# EAGLE design AddOnBoardArduinoRTC (EAGLE 7.6.0)
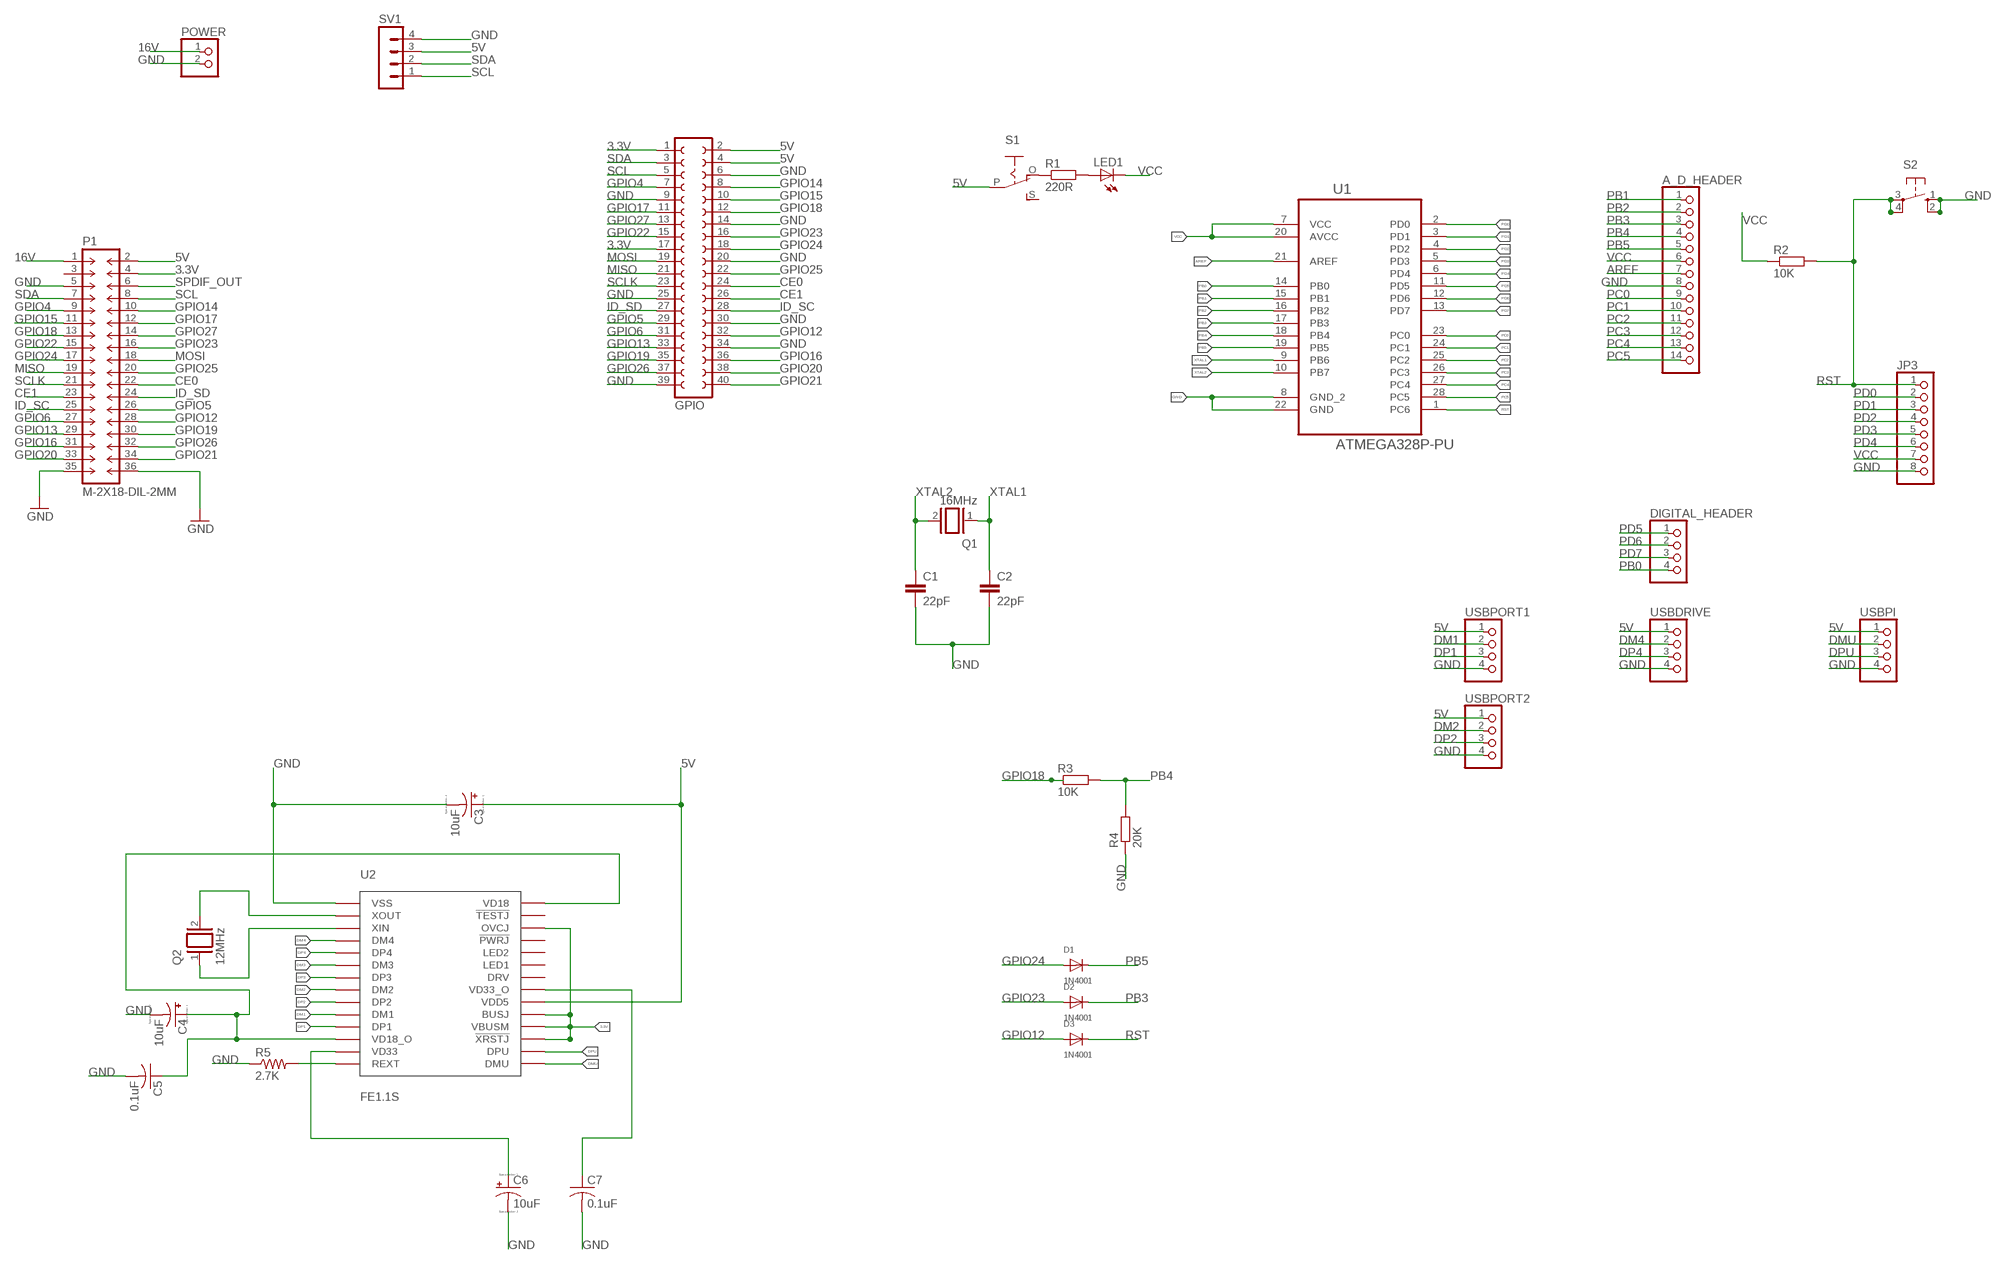
[diagram p0: schematic, sheet 1]

## Parts
A_D_HEADER  PINHD-1X14  [1X14]
C1  22pF  C-EU025-024X044  [C025-024X044]
C2  22pF  C-EU025-024X044  [C025-024X044]
C3  10uF  CPOL-US153CLV-0605  [153CLV-0605]
C4  10uF  CPOL-US153CLV-0605  [153CLV-0605]
C5  0.1uF  C-USC1206  [C1206]
C6  10uF  CPOL-US153CLV-0605  [153CLV-0605]
C7  0.1uF  C-USC1206  [C1206]
D1  1N4001  DIODESMA  [SMADIODE]
D2  1N4001  DIODESMA  [SMADIODE]
D3  1N4001  DIODESMA  [SMADIODE]
DIGITAL_HEADER  PINHD-1X4  [1X04]
GPIO  FE20-2  [FE20-2]
JP3  PINHD-1X8  [1X08]
LED1  LED5MM  [LED5MM]
P1  M-2X18-DIL-2MM  [DIL-2MM-2X18]
POWER  PINHD-1X2  [1X02]
Q1  16MHz  XTAL/S  [QS]
Q2  12MHz  XTAL/S  [QS]
R1  220R  R-EU_M1206  [M1206]
R2  10K  R-EU_M1206  [M1206]
R3  10K  R-EU_M1206  [M1206]
R4  20K  R-EU_M1206  [M1206]
R5  2.7K  R-US_M1206  [M1206]
S1  EG1218S  [EG1218]
S2  10-XX  [B3F-10XX]
SV1  MA04-1  [MA04-1]
U1  ATMEGA328P-PU  [DIP254P762X457-28]
U2  FE1.1S  [SSOP-28]
USBDRIVE  PINHD-1X4  [1X04]
USBPI  PINHD-1X4  [1X04]
USBPORT1  PINHD-1X4  [1X04]
USBPORT2  PINHD-1X4  [1X04]

## Nets
3.3V: GPIO.1 GPIO.17 P1.4 U2.17(!XRSTJ) U2.18(VBUSM) U2.19(BUSJ) U2.26(OVCJ)
5V: C3.+ GPIO.2 GPIO.4 P1.2 S1.P SV1.3 U2.20(VDD5) USBDRIVE.1 USBPI.1 USBPORT1.1 USBPORT2.1
16V: P1.1 POWER.1
AREF: A_D_HEADER.7 U1.21(AREF)
CE0: GPIO.24 P1.22
CE1: GPIO.26 P1.23
DM1: U2.10(DM1) USBPORT1.2
DM2: U2.8(DM2) USBPORT2.2
DM3: U2.6(DM3)
DM4: U2.4(DM4) USBDRIVE.2
DMU: U2.15(DMU) USBPI.2
DP1: U2.11(DP1) USBPORT1.3
DP2: U2.9(DP2) USBPORT2.3
DP3: U2.7(DP3)
DP4: U2.5(DP4) USBDRIVE.3
DPU: U2.16(DPU) USBPI.3
GND: A_D_HEADER.8 C1.2 C2.2 C3.- C4.- C5.2 C6.- C7.2 GPIO.6 GPIO.9 GPIO.14 GPIO.20 GPIO.25 GPIO.30 GPIO.34 GPIO.39 JP3.8 P1.5 P1.35 P1.36 POWER.2 R4.1 R5.1 S2.1(S) S2.2(S1) SV1.4 U1.8(GND_2) U1.22(GND) U2.1(VSS) USBDRIVE.4 USBPI.4 USBPORT1.4 USBPORT2.4
GPIO4: GPIO.7 P1.9
GPIO5: GPIO.29 P1.26
GPIO6: GPIO.31 P1.27
GPIO12: D3.A GPIO.32 P1.28
GPIO13: GPIO.33 P1.29
GPIO14: GPIO.8 P1.10
GPIO15: GPIO.10 P1.11
GPIO16: GPIO.36 P1.31
GPIO17: GPIO.11 P1.12
GPIO18: GPIO.12 P1.13 R3.1
GPIO19: GPIO.35 P1.30
GPIO20: GPIO.38 P1.33
GPIO21: GPIO.40 P1.34
GPIO22: GPIO.15 P1.15
GPIO23: D2.A GPIO.16 P1.16
GPIO24: D1.A GPIO.18 P1.17
GPIO25: GPIO.22 P1.20
GPIO26: GPIO.37 P1.32
GPIO27: GPIO.13 P1.14
ID_SC: GPIO.28 P1.25
ID_SD: GPIO.27 P1.24
MISO: GPIO.21 P1.19
MOSI: GPIO.19 P1.18
N$2: Q2.2 U2.2(XOUT)
N$3: Q2.1 U2.3(XIN)
N$12: R5.2 U2.14(REXT)
N$13: C6.+ U2.13(VD33)
N$14: C4.+ C5.1 U2.12(VD18_O) U2.28(VD18)
N$15: C7.1 U2.21(VD33_O)
N$27: R1.1 S1.O
N$28: LED1.A R1.2
PB0: DIGITAL_HEADER.4 U1.14(PB0)
PB1: A_D_HEADER.1 U1.15(PB1)
PB2: A_D_HEADER.2 U1.16(PB2)
PB3: A_D_HEADER.3 D2.C U1.17(PB3)
PB4: A_D_HEADER.4 R3.2 R4.2 U1.18(PB4)
PB5: A_D_HEADER.5 D1.C U1.19(PB5)
PC0: A_D_HEADER.9 U1.23(PC0)
PC1: A_D_HEADER.10 U1.24(PC1)
PC2: A_D_HEADER.11 U1.25(PC2)
PC3: A_D_HEADER.12 U1.26(PC3)
PC4: A_D_HEADER.13 U1.27(PC4)
PC5: A_D_HEADER.14 U1.28(PC5)
PD0: JP3.2 U1.2(PD0)
PD1: JP3.3 U1.3(PD1)
PD2: JP3.4 U1.4(PD2)
PD3: JP3.5 U1.5(PD3)
PD4: JP3.6 U1.6(PD4)
PD5: DIGITAL_HEADER.1 U1.11(PD5)
PD6: DIGITAL_HEADER.2 U1.12(PD6)
PD7: DIGITAL_HEADER.3 U1.13(PD7)
RST: D3.C JP3.1 R2.2 S2.3(P) S2.4(P1) U1.1(PC6)
SCL: GPIO.5 P1.8 SV1.1
SCLK: GPIO.23 P1.21
SDA: GPIO.3 P1.7 SV1.2
SPDIF_OUT: P1.6
VCC: A_D_HEADER.6 JP3.7 LED1.K(C) R2.1 U1.7(VCC) U1.20(AVCC)
XTAL1: C2.1 Q1.1 U1.9(PB6)
XTAL2: C1.1 Q1.2 U1.10(PB7)
Unconnected: P1.3 S1.S U2.22(DRV) U2.23(LED1) U2.24(LED2) U2.25(!PWRJ) U2.27(!TESTJ)

## Library data of the parts
A_D_HEADER = adafruit:PINHD-1X14: PIN HEADER
C1 C2 = rcl:C-EU: CAPACITOR, European symbol
C3 C4 C6 = resistor:CPOL-US: POLARIZED CAPACITOR, American symbol
C5 C7 = adafruit:C-US: CAPACITOR, American symbol
D1-D3 = adafruit:DIODE: Diode SMADIODE - SMA Surface Mount Package 20V 1A Schottky Diode Digikey: 641-1014-6-ND DO-1N4148 - Through Hole Small Current Diode SOD-123 20V 1 A (.5mV Vf) Schottky Diode - Digikey: MBRX120TPMSCT-ND SOD-323 10V 570mA (.38mV Vf, 3ns) Schottky Diode - Digikey: ZLLS410CT-ND SOD-523 30V 30mA Schottky Diode (RB751S-40TE61) - Digikey: RB751S-40TE61CT-ND SOT23-R/W - SOT23 Package (R = Solder Paste/Reflow Ovens, W = Hand-Soldering) BAT54Film 40V 300mA - Digikey: 497-7162-1-ND
DIGITAL_HEADER USBDRIVE USBPI USBPORT1 USBPORT2 = pinhead:PINHD-1X4: PIN HEADER
GPIO = con-lsta:FE20-2: FEMALE HEADER; OC_FARNELL: unknown; OC_NEWARK: unknown
JP3 = pinhead:PINHD-1X8: PIN HEADER
LED1 = adafruit:LED: LED OSRAM: - CHIPLED LG R971, LG N971, LY N971, LG Q971, LY Q971, LO R971, LY R971 LH N974, LH R974 LS Q976, LO Q976, LY Q976 LO Q996 - Hyper CHIPLED LW Q18S LB Q993, LB Q99A, LB R99A - SideLED LS A670, LO A670, LY A670, LG A670, LP A670 LB A673, LV A673, LT A673, LW A673 LH A674 LY A675 LS A676, LA A676, LO A676, LY A676, LW A676 LS A679, LY A679, LG A679 - Hyper Micro SIDELED® LS Y876, LA Y876, LO Y876, LY Y876 LT Y87S - SmartLED LW L88C, LW L88S LB L89C, LB L89S, LG L890 LS L89K, LO L89K, LY L89K LS L896, LA L896, LO L896, LY L896 - TOPLED LS T670, LO T670, LY T670, LG T670, LP T670 LSG T670, LSP T670, LSY T670, LOP T670, LYG T670 LG T671, LOG T671, LSG T671 LB T673, LV T673, LT T673, LW T673 LH T674 LS T676, LA T676, LO T676, LY T676, LB T676, LH T676, LSB T676, LW T676 LB T67C, LV T67C, LT T67C, LS T67K, LO T67K, LY T67K, LW E67C LS E67B, LA E67B, LO E67B, LY E67B, LB E67C, LV E67C, LT E67C LW T67C LS T679, LY T679, LG T679 LS T770, LO T770, LY T770, LG T770, LP T770 LB T773, LV T773, LT T773, LW T773 LH T774 LS E675, LA E675, LY E675, LS T675 LS T776, LA T776, LO T776, LY T776, LB T776 LHGB T686 LT T68C, LB T68C - Hyper Mini TOPLED® LB M676 - Mini TOPLED Santana® LG M470 LS M47K, LO M47K, LY M47K Source: http://www.osram.convergy.de/
P1 = con-headers-jp:M-2X18-: MALE HEADER
POWER = pinhead:PINHD-1X2: PIN HEADER
Q1 Q2 = special:XTAL/S: CRYSTAL
R1-R4 = rcl:R-EU_: RESISTOR, European symbol
R5 = adafruit:R-US_: RESISTOR, American symbol
S1 = adafruit:EG1218: SLIDING SWITCH 0.1" spacing through hole, vertical SPDT slide switch http://www.ladyada.net/library/pcb/eaglelibrary.html
S2 = switch-omron:10-XX: OMRON SWITCH; MPN: B3F-1000; OC_FARNELL: 176432; OC_NEWARK: 36M3542
SV1 = con-lstb:MA04-1: PIN HEADER; OC_FARNELL: unknown; OC_NEWARK: unknown
U1 = Atmel_By_element14_Batch_1-00:ATMEGA328P-PU: 8-bit Microcontroller with In-System Programmable Flash; MPN: ATMEGA328P-PU; OC_FARNELL: 1715487; OC_NEWARK: 15R0268; PACKAGE: PDIP-28; SUPPLIER: Atmel
U2 = kmc-parts:FE1.1S: The FE1.1s is a highly integrated, high quality, high performance, low power consumption, yet low cost solution for USB 2.0 High Speed 4-Port Hub.

## Board
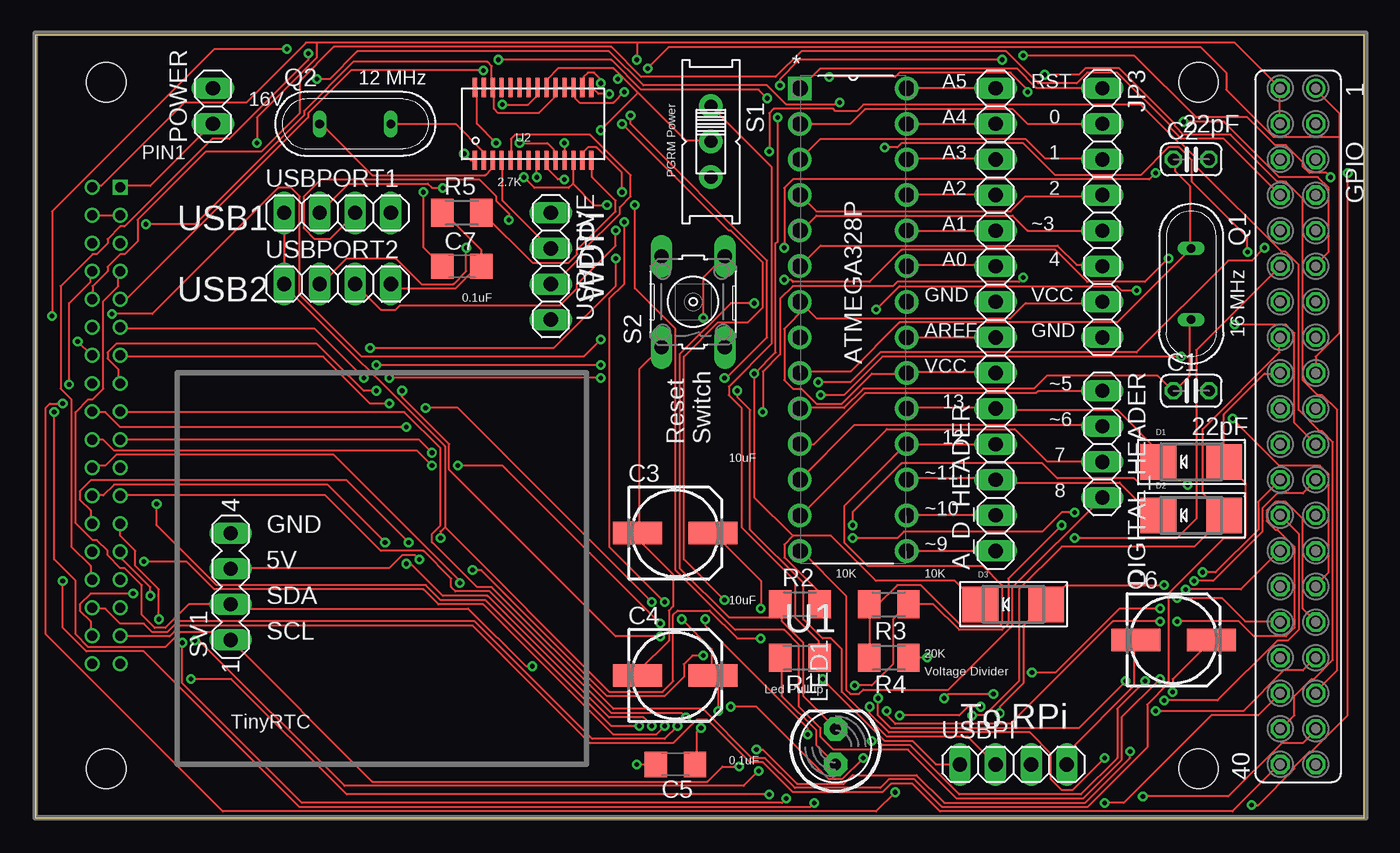
[diagram p1: board, top side]
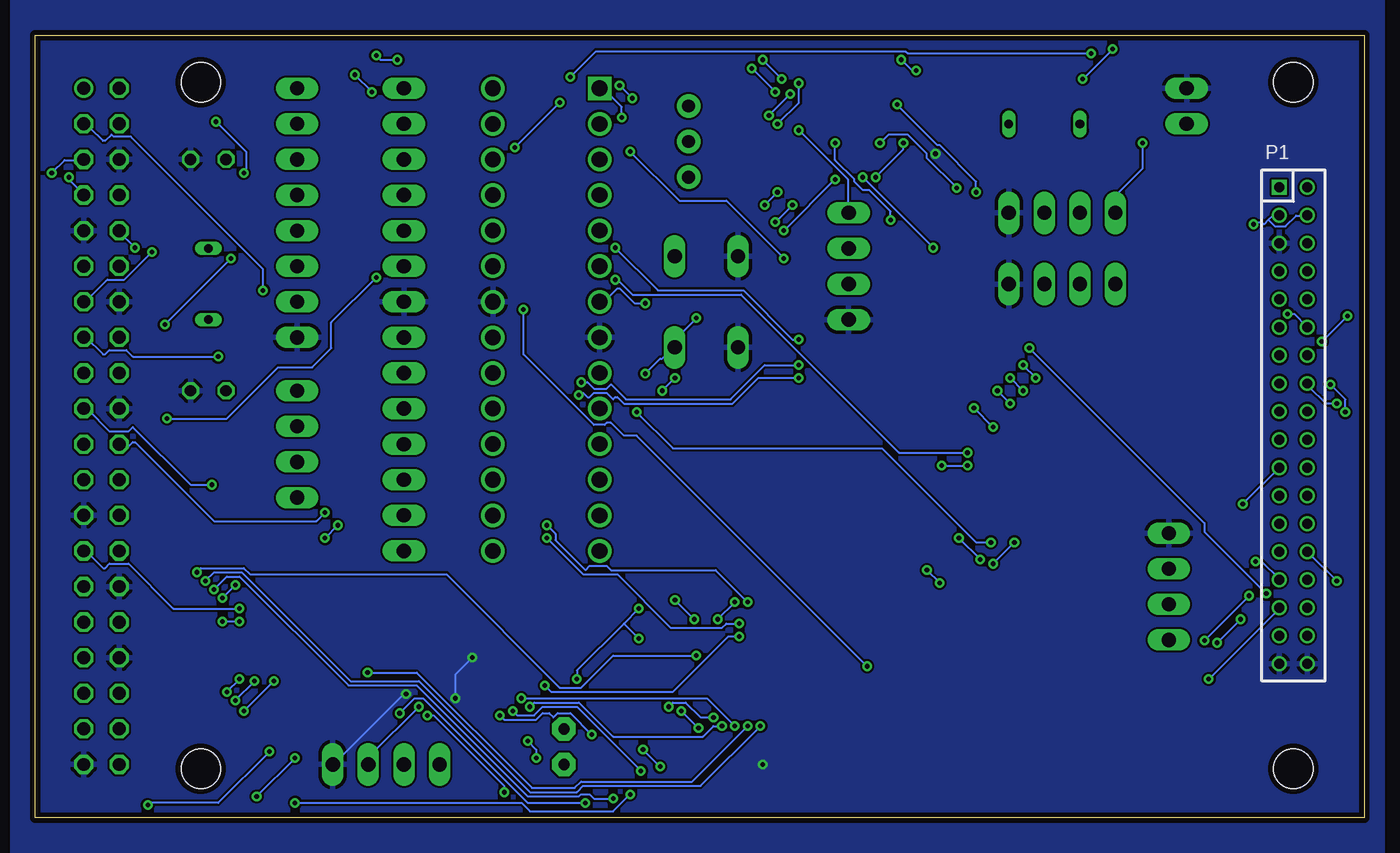
[diagram p2: board, bottom side, seen from below]

Size 94.92 x 55.87 mm. Coordinates in mm from the lower left corner, seen from the top.
Outline: 0,0 94.92,0 94.92,55.87 0,55.87 0,0
Copper layers (1*16): Top 0.0356mm / dielectric 1.5011mm / Bottom 0.0356mm
Design rules "LaenPCBOrder": minimum track width 6mil, minimum drill 13mil, track to track 6mil, track to pad 6mil, pad to pad 6mil, via to via 6mil, smd to smd 6mil, copper to edge 15mil, drill to drill 6mil, minimum pad ring 7mil, minimum via ring 7mil, stop-mask expansion 3mil, vias tented up to drill 0mil, thermal gap 10mil
Holes 2.8 mm at 5.08,52.5 5.08,3.5 83.08,52.5 83.08,3.5

### Footprints (pad centres in the part's own frame; a part is rotated, then mirrored left to right if it is on the bottom)
1X14 = drill 1.016 long: 1 -16.51,0; 2 -13.97,0; 3 -11.43,0; 4 -8.89,0; 5 -6.35,0; 6 -3.81,0; 7 -1.27,0; 8 1.27,0; 9 3.81,0; 10 6.35,0; 11 8.89,0; 12 11.43,0; 13 13.97,0; 14 16.51,0
C025-024X044 = drill 0.813 octagon: 1 -1.27,0; 2 1.27,0
153CLV-0605 = smd 3.5 x 1.6: + 2.7,0; - -2.7,0
C1206 = smd 1.6 x 1.8: 1 -1.4,0; 2 1.4,0
SMADIODE = smd 2.54 x 2.54: A 2.349,0; C -2.349,0
1X04 = drill 1.016 long: 1 -3.81,0; 2 -1.27,0; 3 1.27,0; 4 3.81,0
FE20-2 = drill 0.914: 1 -24.13,1.27 | drill 0.914 octagon: 2 -24.13,-1.27; 3 -21.59,1.27; 4 -21.59,-1.27; 5 -19.05,1.27; 6 -19.05,-1.27; 7 -16.51,1.27; 8 -16.51,-1.27; 9 -13.97,1.27; 10 -13.97,-1.27; 11 -11.43,1.27; 12 -11.43,-1.27; 13 -8.89,1.27; 14 -8.89,-1.27; 15 -6.35,1.27; 16 -6.35,-1.27; 17 -3.81,1.27; 18 -3.81,-1.27; 19 -1.27,1.27; 20 -1.27,-1.27; 21 1.27,1.27; 22 1.27,-1.27; 23 3.81,1.27; 24 3.81,-1.27; 25 6.35,1.27; 26 6.35,-1.27; 27 8.89,1.27; 28 8.89,-1.27; 29 11.43,1.27; 30 11.43,-1.27; 31 13.97,1.27; 32 13.97,-1.27; 33 16.51,1.27; 34 16.51,-1.27; 35 19.05,1.27; 36 19.05,-1.27; 37 21.59,1.27; 38 21.59,-1.27; 39 24.13,1.27; 40 24.13,-1.27
1X08 = drill 1.016 long: 1 -8.89,0; 2 -6.35,0; 3 -3.81,0; 4 -1.27,0; 5 1.27,0; 6 3.81,0; 7 6.35,0; 8 8.89,0
LED5MM = drill 0.813 pad 1.676 octagon: A -1.27,0; K 1.27,0
DIL-2MM-2X18 = drill 0.711 square: 1 -17,-1 | drill 0.711: 2 -17,1; 3 -15,-1; 4 -15,1; 5 -13,-1; 6 -13,1; 7 -11,-1; 8 -11,1; 9 -9,-1; 10 -9,1; 11 -7,-1; 12 -7,1; 13 -5,-1; 14 -5,1; 15 -3,-1; 16 -3,1; 17 -1,-1; 18 -1,1; 19 1,-1; 20 1,1; 21 3,-1; 22 3,1; 23 5,-1; 24 5,1; 25 7,-1; 26 7,1; 27 9,-1; 28 9,1; 29 11,-1; 30 11,1; 31 13,-1; 32 13,1; 33 15,1; 34 15,-1; 35 17,1; 36 17,-1
1X02 = drill 1.016 long: 1 -1.27,0; 2 1.27,0
QS = drill 0.61 long: 1 -2.54,0; 2 2.54,0
M1206 = smd 1.6 x 2: 1 -1.4,0; 2 1.4,0
EG1218 = drill 0.9 pad 1.676: O -2.54,0; P 0,0; S 2.54,0
B3F-10XX = drill 1.016 long: 1 -3.251,2.261; 2 3.251,2.261; 3 -3.251,-2.261; 4 3.251,-2.261
MA04-1 = drill 1.016 long: 1 -3.81,0; 2 -1.27,0; 3 1.27,0; 4 3.81,0
DIP254P762X457-28 = drill 1.118 square: 1 -7.62,33.02 | drill 1.118: 2 -7.62,30.48; 3 -7.62,27.94; 4 -7.62,25.4; 5 -7.62,22.86; 6 -7.62,20.32; 7 -7.62,17.78; 8 -7.62,15.24; 9 -7.62,12.7; 10 -7.62,10.16; 11 -7.62,7.62; 12 -7.62,5.08; 13 -7.62,2.54; 14 -7.62,0; 15 0,0; 16 0,2.54; 17 0,5.08; 18 0,7.62; 19 0,10.16; 20 0,12.7; 21 0,15.24; 22 0,17.78; 23 0,20.32; 24 0,22.86; 25 0,25.4; 26 0,27.94; 27 0,30.48; 28 0,33.02
SSOP-28 = smd 0.3 x 1.375: 1 -4.16,-2.6; 2 -3.52,-2.6; 3 -2.88,-2.6; 4 -2.24,-2.6; 5 -1.6,-2.6; 6 -0.96,-2.6; 7 -0.32,-2.6; 8 0.32,-2.6; 9 0.96,-2.6; 10 1.6,-2.6; 11 2.24,-2.6; 12 2.88,-2.6; 13 3.52,-2.6; 14 4.16,-2.6; 15 4.16,2.6; 16 3.52,2.6; 17 2.88,2.6; 18 2.24,2.6; 19 1.6,2.6; 20 0.96,2.6; 21 0.32,2.6; 22 -0.32,2.6; 23 -0.96,2.6; 24 -1.6,2.6; 25 -2.24,2.6; 26 -2.88,2.6; 27 -3.52,2.6; 28 -4.16,2.6

### Placement (x,y rotation side)
A_D_HEADER  68.58,35.56 90 top
C1  82.55,30.48 0 top
C2  82.55,46.99 0 top
C3  45.72,20.32 0 top
C4  45.72,10.16 0 top
C5  45.72,3.81 180 top
C6  81.28,12.7 0 top
C7  30.48,39.37 0 top
D1  82.55,25.4 0 top
D2  82.55,21.59 0 top
D3  69.85,15.24 0 top
DIGITAL_HEADER  76.2,26.67 270 top
GPIO  90.17,27.94 270 top
JP3  76.2,43.18 270 top
LED1  57.15,5.08 90 top
P1  5.08,28 270 bottom
POWER  12.7,50.8 90 top
Q1  82.55,38.1 270 top
Q2  22.86,49.53 0 top
R1  54.61,11.43 180 top
R2  54.61,15.24 0 top
R3  60.96,15.24 180 top
R4  60.96,11.43 180 top
R5  30.48,43.18 0 top
S1  48.26,48.26 270 top
S2  46.99,36.83 90 top
SV1  13.97,16.51 90 top
U1  62.23,19.05 0 top
U2  35.56,49.53 0 top
USBDRIVE  36.83,39.37 270 top
USBPI  69.85,3.81 0 top
USBPORT1  21.59,43.18 0 top
USBPORT2  21.59,38.1 0 top

### Tracks (layer width: path | path; a pad name or v marks a point on that pad's centre or on a via)
3.3V  (via drill 0.33)
  Top 0.152: GPIO.17 91.44,32.92 93.12,34.59 93.12,48.62 | 93.12,48.62 93.12,50.29 91.44,51.97 GPIO.1 | 5.94,42.98 4.12,42.98 P1.4 | v7.92,42.37 11.43,42.37 19.2,50.14 19.2,50.44 22.71,53.95 32.31,53.95 32.61,53.65 32.61,52.27 U2.26 32.77,52.12 32.77,50.6 33.07,50.29 35.97,50.29 37.03,51.36 37.03,52.12 U2.19 37.19,52.12 U2.18 37.95,52.12 38.41,52.12 U2.17 38.56,52.12 38.56,51.36 38.86,51.05 41.3,51.05 v42.06,51.82 | 93.12,48.62 88.39,48.62 85.04,51.97 85.04,53.19 83.21,55.02 45.26,55.02 v43.74,53.49
  Bottom 0.152: 6.1,42.98 6.55,42.98 6.86,42.67 | 6.86,42.67 7.16,42.37 7.32,42.52 7.77,42.52 v7.92,42.37 | v42.06,51.82 v43.74,53.49 | 6.86,42.67 6.4,42.22 5.64,42.22 4.88,42.98 4.12,42.98 P1.4
5V  (via drill 0.33)
  Top 0.152: USBPI.1 64.31,3.81 62.64,5.49 60.66,5.49 v56.24,9.91 | v51.82,14.94 51.82,16.92 48.46,20.27 C3.+ | v27.43,18.44 27.13,18.75 26.21,18.75 25.3,17.83 14.02,17.83 SV1.3 | v28.96,19.96 28.96,20.42 29.26,20.73 | 29.26,20.73 29.26,26.52 17.68,38.1 USBPORT2.1 17.83,38.1 17.83,43.13 USBPORT1.1 | v51.82,12.8 50.14,12.8 48.16,14.78 45.87,14.78 45.57,14.48 45.57,9.75 44.81,8.99 41,8.99 29.26,20.73 | 42.98,51.82 46.48,48.31 48.16,48.31 S1.P | 42.98,51.82 41.91,52.88 | 41.91,52.88 41.3,53.49 37.34,53.49 36.58,52.73 36.58,52.27 U2.20 | v40.39,49.07 42.98,51.66 42.98,51.82 | 42.98,55.32 85.65,55.32 GPIO.2 88.85,51.97 88.85,49.53 GPIO.4 | 42.98,55.32 20.12,55.32 | 20.12,55.32 19.36,55.32 15.09,51.05 10.67,51.05 4.72,45.11 4.12,45.11 P1.2 | 41.91,52.88 41.76,52.88 v41.6,52.73 | 42.98,55.32 v42.98,54.1 | v15.85,48.16 15.85,49.99 20.12,54.25 20.12,55.32
  Bottom 0.152: v56.24,9.91 56.24,10.52 52.88,13.87 | v51.82,14.94 52.88,13.87 | v28.96,19.96 v27.43,18.44 | v51.82,12.8 52.88,13.87 | v40.39,49.07 36.88,45.57 36.88,43.28 USBDRIVE.1 | v42.98,54.1 v41.6,52.73 | v15.85,48.16 15.85,46.33 17.68,44.5 17.68,43.28 USBPORT1.1
16V
  Top 0.152: P1.1 6.1,45.11 8.23,45.11 12.65,49.53 POWER.1
AREF
  Top 0.152: U1.21 A_D_HEADER.7
CE0  (via drill 0.33)
  Top 0.152: v30.33,16.76 30.33,16.92 21.34,25.91 5.79,25.91 5.03,25.15 4.12,25.15 P1.22 | v31.24,17.68 31.85,17.68 40.84,8.69 44.96,8.69 46.33,10.06 46.33,10.97 46.94,11.58 v47.7,11.58 | v83.36,17.53 84.28,17.53 87.33,20.57 87.33,22.55 GPIO.24
  Bottom 0.152: v31.24,17.68 v30.33,16.76 | v47.7,11.58 53.65,11.58 55.93,9.3 57.45,9.3 65.53,17.37 79.55,17.37 80.01,17.83 83.06,17.83 v83.36,17.53
CE1  (via drill 0.33)
  Top 0.152: v46.48,7.16 46.18,7.47 41.15,7.47 32.46,16.15 30.02,16.15 29.72,16.46 29.72,17.07 27.74,19.05 24.69,19.05 20.73,23.01 6.1,23.01 P1.23 | v49.68,7.92 51.51,7.92 56.69,2.74 57.61,2.74 v59.13,4.27 | v59.74,5.49 60.2,5.49 60.5,5.18 62.48,5.18 65.99,1.68 74.68,1.68 77.27,4.27 77.27,7.77 v79.25,9.75 | v80.62,8.38 84.43,8.38 88.7,12.65 89.46,12.65 90.22,13.41 90.22,20.27 GPIO.26
  Bottom 0.152: v46.48,7.16 47.4,7.16 48.46,8.23 49.38,8.23 v49.68,7.92 | v59.13,4.27 59.13,4.88 v59.74,5.49 | v80.62,8.38 v79.25,9.75
DM1  (via drill 0.33)
  Top 0.152: v34.59,48.16 36.58,48.16 37.03,47.7 37.03,46.94 U2.10 | v29.11,44.96 28.35,44.96 28.04,45.26 22.4,45.26 USBPORT1.2
  Bottom 0.152: v34.59,48.16 33.98,48.77 32.61,48.77 31.24,47.4 31.24,47.09 v29.11,44.96
DM2  (via drill 0.33)
  Top 0.152: v35.81,45.72 35.81,46.79 U2.8 | v30.79,40.69 30.79,39.01 29.87,38.1 27.58,38.1 25.76,39.93 22.25,39.93 20.42,38.1 USBPORT2.2
  Bottom 0.152: v30.79,40.69 v35.81,45.72
DM4
  Top 0.152: U2.4 33.38,46.79 33.38,44.04 36.73,40.69 USBDRIVE.2
DMU  (via drill 0.33)
  Top 0.152: v41,51.66 40.23,51.66 39.78,52.12 U2.15 | v42.52,50.14 42.52,49.53 52.27,39.78 52.27,34.29 49.38,31.39 v49.23,31.39 | v50.14,30.48 50.14,30.02 51.05,29.11 51.05,20.57 54.86,16.76 54.86,14.17 56.24,12.8 56.84,12.8 57.61,12.04 57.61,8.99 60.81,5.79 66.6,5.79 USBPI.2
  Bottom 0.152: v42.52,50.14 v41,51.66 | v50.14,30.48 v49.23,31.39
DP1  (via drill 0.33)
  Top 0.152: v37.8,48.16 U2.11 | v33.83,42.67 33.83,43.13 32.92,44.04 32.92,44.35 31.7,45.57 20.42,45.57 19.2,44.35 19.2,42.06 19.96,41.3 21.03,41.3 22.86,43.13 USBPORT1.3
  Bottom 0.152: v37.8,48.16 U2.11 36.42,45.57 36.42,45.41 35.81,44.81 35.36,44.81 33.83,43.28 v33.83,42.67
DP2  (via drill 0.33)
  Top 0.152: v37.8,45.57 37.34,45.57 36.58,46.33 36.58,46.79 U2.9 | v41.45,41.91 41.45,40.84 38.71,38.1 38.71,37.8 37.49,36.58 26.06,36.58 25.76,36.27 24.69,36.27 USBPORT2.3
  Bottom 0.152: v41.45,41.91 v37.8,45.57
DP4
  Top 0.152: USBDRIVE.3 37.03,38.1 39.01,40.08 39.01,40.39 41.76,43.13 41.76,43.59 42.52,44.35 42.52,45.87 39.62,48.77 34.29,48.77 33.98,48.46 33.98,46.94 U2.5
DPU  (via drill 0.33)
  Top 0.152: v40.39,52.43 40.39,52.73 39.93,53.19 39.47,53.19 39.17,52.88 39.17,52.27 U2.16 | v41.91,49.53 49.53,41.91 49.68,41.91 51.97,39.62 51.97,36.42 50.9,35.36 48.77,35.36 46.33,32.92 46.33,18.44 v49.23,15.54 | v47.85,14.17 47.85,13.72 55.17,6.4 v55.17,5.94 | v61.72,7.32 65.99,7.32 66.6,7.92 v67.51,7.92
  Bottom 0.152: v40.39,52.43 40.39,51.05 v41.91,49.53 | v47.85,14.17 v49.23,15.54 | v55.17,5.94 56.69,7.47 57.61,7.47 57.91,7.16 58.22,7.47 58.67,7.47 59.13,7.01 61.42,7.01 v61.72,7.32 | v67.51,7.92 71.02,4.42 71.02,3.81 USBPI.3
GND  (via drill 0.33)
  Top 0.152: C4.- 43.13,10.21 43.13,10.52 45.26,12.65 45.26,14.78 45.57,15.09 45.57,17.37 43.13,19.81 43.13,20.27 C3.- 43.13,20.42 43.13,32 44.65,33.53 S2.1 | R5.1 29.11,43.28 31.85,40.54 31.85,39.47 C7.2 31.85,39.32 31.55,39.32 30.02,37.8 25.76,37.8 25.45,38.1 USBPORT2.4 | v30.63,47.4 31.09,46.94 U2.1 | v42.98,3.81 C5.2 | v63.7,11.43 R4.1 | C6.- 78.49,12.65 78.49,9.45 73.76,4.72 73.76,3.81 USBPI.4 | v68.43,8.84 65.23,8.84 v64.92,8.53
  Bottom 0.152: v68.43,8.84 68.58,8.84 73.61,3.81 USBPI.4 | v64.92,8.53 64.92,10.21 v63.7,11.43
  pour Bottom: -1.27,58.42 -1.27,-2.54 96.52,-2.54 96.52,58.42
GPIO4  (via drill 0.33)
  Top 0.152: v32,53.34 22.55,53.34 19.51,50.29 19.51,49.99 6.55,37.03 6.1,37.03 P1.9 | v33.07,54.1 41.15,54.1 43.28,51.97 51.66,51.97 v52.27,51.36 | v53.19,52.27 53.19,52.73 54.56,54.1 v69.04,54.1 | v70.56,54.41 78.49,54.41 82.91,49.99 86.56,49.99 88.54,48.01 89.31,48.01 90.53,46.79 90.53,46.48 90.98,46.02 92.2,46.02 v92.51,45.72
  Bottom 0.152: v32,53.34 32.31,53.34 v33.07,54.1 | v53.19,52.27 v52.27,51.36 | v69.04,54.1 70.26,54.1 v70.56,54.41 | v92.51,45.72 92.51,45.57 91.44,44.5 GPIO.7
GPIO5  (via drill 0.33)
  Top 0.152: v26.67,19.66 22.25,24.08 3.96,24.08 3.2,23.32 3.2,22.71 3.96,21.95 3.96,21.03 P1.26 | v51.97,28.96 51.97,31.85 53.19,33.07 53.19,37.03 54.1,37.95 61.27,37.95 61.57,38.25 70.26,38.25 v70.56,38.56 | v85.5,28.5 88.85,25.15 91.75,25.15 92.35,24.54 92.35,17.53 91.44,16.61 GPIO.29
  Bottom 0.152: v26.67,19.66 27.74,19.66 34.44,26.36 49.38,26.36 v51.97,28.96 | v70.56,38.56 73.76,35.36 73.76,33.53 75.13,32.16 77.57,32.16 81.23,28.5 v85.5,28.5
GPIO6  (via drill 0.33)
  Top 0.152: v8.23,15.85 8.23,16.46 6.1,18.59 6.1,18.9 P1.27 | v11.43,12.65 11.73,12.65 22.1,2.29 50.6,2.29 v51.66,3.35 | v60.81,7.62 60.81,7.32 61.42,6.71 69.65,6.71 76.96,14.02 v80.31,14.02 | v81.53,14.02 85.95,14.02 87.02,12.95 89.31,12.95 89.92,13.56 89.92,19.36 88.7,20.57 88.54,20.57 87.94,21.18 87.94,21.95 88.54,22.55 89.31,22.55 90.53,21.34 90.53,14.94 91.44,14.02 GPIO.31
  Bottom 0.152: v11.43,12.65 v8.23,15.85 | v51.66,3.35 56.24,7.92 58.67,7.92 59.28,7.32 60.5,7.32 v60.81,7.62 | v81.53,14.02 v80.31,14.02
GPIO12  (via drill 0.33)
  Top 0.152: v1.98,16.92 1.98,13.56 3.66,11.89 7.77,11.89 18.9,0.76 55.32,0.76 v55.63,1.07 | v68.89,7.47 68.89,7.92 70.56,9.6 70.56,13.72 72.08,15.24 D3.A 72.24,15.24 73.61,16.61 v80.62,16.61 | v81.53,15.7 84.73,15.7 86.41,14.02 88.85,14.02 GPIO.32
  Bottom 0.152: v1.98,16.92 3.96,18.9 P1.28 | v55.63,1.07 59.74,1.07 67.21,8.53 67.82,8.53 v68.89,7.47 | v80.62,16.61 v81.53,15.7
GPIO13  (via drill 0.33)
  Top 0.152: v7.77,18.29 10.82,18.29 12.8,16.31 27.74,16.31 28.8,15.24 32,15.24 41.3,5.94 44.35,5.94 v44.96,6.55 | v60.2,8.53 60.2,7.32 61.11,6.4 74.52,6.4 v77.88,9.75 | v80.01,7.62 86.26,7.62 89.15,10.52 90.53,10.52 GPIO.33
  Bottom 0.152: v7.77,18.29 7.32,18.29 6.1,17.07 P1.29 | v44.96,6.55 46.94,8.53 v60.2,8.53 | v80.01,7.62 v77.88,9.75
GPIO14
  Top 0.152: GPIO.8 84.89,48.46 81.84,48.46 81.08,49.23 81.08,49.38 77.27,53.19 75.13,53.19 74.37,52.43 71.63,52.43 69.34,54.71 54.71,54.71 52.88,52.88 43.28,52.88 41.15,55.02 21.34,55.02 18.9,52.58 18.9,50.29 16.15,47.55 12.19,47.55 7.32,42.67 7.32,41.15 6.4,40.23 6.1,40.23 5.18,39.32 5.18,39.01 4.12,37.95 4.12,37.03 P1.10
GPIO15  (via drill 0.33)
  Top 0.152: v23.47,31.39 19.96,34.9 6.1,34.9 P1.11 | v40.39,32.31 v24.38,32.31 | v55.93,31.09 58.22,31.09 60.35,33.22 78.64,33.22 85.19,39.78 86.87,39.78 v87.78,40.69
  Bottom 0.152: v24.38,32.31 v23.47,31.39 | v40.39,32.31 42.82,32.31 45.26,29.87 52.73,29.87 53.8,30.94 54.1,30.63 55.02,30.63 55.47,31.09 v55.93,31.09 | v87.78,40.69 89,41.91 GPIO.10
GPIO16  (via drill 0.33)
  Top 0.152: v11.12,9.91 14.02,9.91 22.25,1.68 v52.43,1.68 | v76.35,1.07 77.72,1.07 83.97,7.32 87.33,7.32 GPIO.36
  Bottom 0.152: v11.12,9.91 6.1,14.94 P1.31 | v52.43,1.68 53.65,0.46 59.59,0.46 60.2,1.07 v76.35,1.07
GPIO17  (via drill 0.33)
  Top 0.152: v5.49,35.97 8.38,35.97 17.37,44.96 18.29,44.96 18.9,44.35 18.9,37.34 23.32,32.92 39.17,32.92 v40.39,34.14 | v53.49,40.69 53.49,44.96 54.1,45.57 79.55,45.57 v80.01,46.02 | v81.99,49.68 84.89,49.68 88.85,45.72 91.59,45.72 92.35,44.96 92.35,40.39 91.44,39.47 GPIO.11
  Bottom 0.152: v5.49,35.97 5.33,35.81 5.18,35.97 5.03,35.97 4.12,35.05 P1.12 | v40.39,34.14 40.84,34.14 44.35,37.64 50.44,37.64 v53.49,40.69 | v80.01,46.02 80.01,46.18 79.86,46.33 79.86,47.55 v81.99,49.68
GPIO18  (via drill 0.33)
  Top 0.152: v73.3,20.88 69.49,17.07 69.49,13.87 69.04,13.41 65.99,13.41 64.16,15.24 R3.1 62.33,15.24 61.27,14.17 61.27,10.97 59.74,9.45 v58.52,9.45 | v74.22,19.96 81.53,19.96 82.91,21.34 82.91,33.38 GPIO.12 | v25.3,29.57 23.93,29.57 20.57,32.92 6.1,32.92 P1.13 | v26.21,30.48 26.21,30.02 29.57,26.67 29.57,24.84 41.45,12.95 v44.65,12.95
  Bottom 0.152: v74.22,19.96 v73.3,20.88 | v26.21,30.48 v25.3,29.57 | v44.65,12.95 45.41,12.95 49.38,8.99 58.06,8.99 v58.52,9.45
GPIO19  (via drill 0.33)
  Top 0.152: v19.51,54.56 19.51,54.1 13.87,48.46 12.65,48.46 6.4,42.22 6.1,42.22 5.18,41.3 5.18,41 4.42,40.23 4.12,40.23 1.83,37.95 1.83,30.63 2.59,29.87 2.59,19.36 3.96,17.98 3.96,17.07 P1.30 | v56.69,52.88 61.42,52.88 61.72,53.19 69.65,53.19 70.87,51.97 v70.87,51.82 | v72.08,53.03 74.52,53.03 74.98,53.49 77.42,53.49 81.38,49.53 81.38,49.38 81.99,48.77 85.34,48.77 88.7,45.41 89.31,45.41 90.53,44.2 90.53,31.24 91.59,30.18 91.9,30.18 92.96,29.11 92.96,10.52 91.44,8.99 GPIO.35
  Bottom 0.152: v19.51,54.56 32.61,54.56 32.77,54.71 54.86,54.71 v56.69,52.88 | v72.08,53.03 v70.87,51.82
GPIO20  (via drill 0.33)
  Top 0.152: v7.01,16 3.96,16 3.2,15.24 3.2,14.78 3.96,14.02 3.96,13.11 P1.33 | v23.93,33.53 37.03,33.53 41.45,37.95 v41.45,39.93 | v52.43,47.55 52.43,50.29 52.73,50.6 57,50.6 57.15,50.44 58.67,50.44 59.13,50.9 78.94,50.9 81.69,48.16 81.84,48.16 82.91,47.09 82.91,46.48 89,40.39 89.31,40.39 90.22,39.47 90.22,29.11 91.75,27.58 91.9,27.58 92.66,26.82 92.66,11.28 91.29,9.91 91.14,9.91 89.92,8.69 89.92,7.32 89,6.4 GPIO.38
  Bottom 0.152: v7.01,16 11.43,20.42 11.43,21.03 v23.93,33.53 | v41.45,39.93 45.57,44.04 48.92,44.04 v52.43,47.55
GPIO21
  Top 0.152: P1.34 6.1,12.95 9.6,12.95 10.36,13.72 31.24,13.72 39.62,5.33 45.57,5.33 47.24,7.01 48.01,7.01 51.05,3.96 51.97,3.96 54.1,1.83 60.5,1.83 61.11,2.44 62.64,2.44 64.62,0.46 85.5,0.46 88.85,3.81 GPIO.40
GPIO22  (via drill 0.33)
  Top 0.152: v24.38,30.48 23.47,30.48 20.12,33.83 5.79,33.83 5.18,33.22 5.18,32.77 5.94,32 5.94,31.09 P1.15 | v40.39,31.39 v25.3,31.39 | v56.08,30.18 57.76,30.18 60.5,32.92 v81.84,32.92
  Bottom 0.152: v25.3,31.39 v24.38,30.48 | v40.39,31.39 43.28,31.39 45.11,29.57 52.88,29.57 53.34,30.02 53.49,30.02 53.65,29.87 54.1,30.33 55.02,30.33 55.32,30.02 55.47,30.02 55.78,30.33 55.93,30.33 v56.08,30.18 | v81.84,32.92 87.94,32.92 88.39,33.38 89.61,33.38 89.92,33.07 90.07,33.07 91.29,34.29 GPIO.15
GPIO23  (via drill 0.33)
  Top 0.152: v1.98,29.57 1.07,29.57 0.76,29.26 0.76,13.11 13.41,0.46 60.05,0.46 v61.42,1.83 | v66.9,7.32 67.82,7.32 70.26,9.75 70.26,16.31 73.3,19.36 82.75,19.36 84.89,21.49 D2.A 84.89,21.64 83.36,23.16 83.36,27.74 88.85,33.22 88.85,34.29 GPIO.16
  Bottom 0.152: v1.98,29.57 2.74,29.57 3.96,30.79 3.96,30.94 P1.16 | v61.42,1.83 61.42,2.29 66.45,7.32 v66.9,7.32
GPIO24
  Top 0.152: P1.17 6.1,28.96 26.36,28.96 28.96,26.36 28.96,20.88 28.35,20.27 28.35,19.66 31.55,16.46 32.61,16.46 41.3,7.77 47.7,7.77 51.21,4.27 52.12,4.27 54.25,2.13 60.35,2.13 60.96,2.74 62.79,2.74 64.77,0.76 75.13,0.76 79.4,5.03 79.4,8.08 80.92,9.6 80.92,16 84.89,19.96 86.26,19.96 86.41,20.12 86.41,23.93 85.04,25.3 D1.A 84.89,25.45 84.89,28.8 87.78,31.7 88.85,31.7 GPIO.18
GPIO25  (via drill 0.33)
  Top 0.152: v28.35,25.15 27.28,26.21 5.64,26.21 4.88,26.98 4.12,26.98 P1.20 | v30.18,25.15 33.38,25.15 v44.65,13.87 | v58.37,19.96 61.57,19.96 62.03,20.42 71.93,20.42 73.3,21.79 v74.22,21.79
  Bottom 0.152: v30.18,25.15 v28.35,25.15 | v44.65,13.87 45.57,13.87 45.87,13.56 49.53,13.56 53.34,17.37 55.78,17.37 v58.37,19.96 | v74.22,21.79 74.83,21.18 82.14,21.18 87.78,26.82 87.94,26.82 88.24,26.52 88.7,26.52 88.85,26.67 GPIO.22
GPIO26  (via drill 0.33)
  Top 0.152: v45.87,6.55 44.96,5.64 39.78,5.64 31.39,14.02 10.21,14.02 9.45,13.26 8.38,13.26 7.77,13.87 6.1,13.87 5.03,14.94 4.12,14.94 P1.32 | v59.59,7.92 59.59,7.47 60.96,6.1 71.02,6.1 72.54,4.57 72.54,2.74 73.3,1.98 74.07,1.98 v76.35,4.27 | v79.1,1.52 85.19,1.52 89,5.33 90.53,5.33 91.44,6.25 GPIO.37
  Bottom 0.152: v45.87,6.55 46.48,6.55 47.24,5.79 53.65,5.79 56.08,8.23 59.28,8.23 v59.59,7.92 | v79.1,1.52 v76.35,4.27
GPIO27  (via drill 0.33)
  Top 0.152: v3.05,33.98 3.96,33.07 P1.14 | v1.22,35.81 1.22,43.28 12.8,54.86 v17.98,54.86 | v20.12,52.73 21.03,52.73 23.01,54.71 41,54.71 43.43,52.27 52.27,52.27 53.65,50.9 57.3,50.9 v57.45,51.05 | v60.66,47.85 61.57,47.85 61.87,48.16 70.56,48.16 72.85,45.87 78.94,45.87 80.92,47.85 81.69,47.85 82.6,46.94 82.6,45.41 86.56,41.45 v86.56,40.39
  Bottom 0.152: v1.22,35.81 v3.05,33.98 | v20.12,52.73 v17.98,54.86 | v60.66,47.85 v57.45,51.05 | v86.56,40.39 88.54,38.41 89.76,38.41 91.44,36.73 GPIO.13
ID_SC  (via drill 0.33)
  Top 0.152: v8.84,14.17 8.84,16.31 7.16,17.98 7.16,19.05 6.1,20.12 6.1,20.88 P1.25 | v10.52,12.5 10.52,9.6 19.05,1.07 53.34,1.07 v53.65,1.37 | v82.14,16.31 86.11,16.31 88.85,19.05 GPIO.28
  Bottom 0.152: v10.52,12.5 v8.84,14.17 | v53.65,1.37 55.02,1.37 55.32,1.68 55.93,1.68 56.08,1.52 59.74,1.52 67.67,9.45 72.54,9.45 80.31,17.22 81.23,17.22 v82.14,16.31
ID_SD  (via drill 0.33)
  Top 0.152: v24.99,19.66 20.88,23.77 5.64,23.77 4.88,23.01 4.12,23.01 P1.24 | v26.52,18.14 26.82,18.14 29.11,15.85 32.31,15.85 41,7.16 43.43,7.16 v44.04,6.55 | v71.17,10.36 72.85,10.36 77.42,14.94 v80.31,14.94
  Bottom 0.152: v26.52,18.14 v24.99,19.66 | v44.04,6.55 48.01,2.59 55.93,2.59 56.39,2.13 59.44,2.13 67.67,10.36 v71.17,10.36 | v80.31,14.94 85.04,14.94 88.24,18.14 89.61,18.14 89.92,17.83 90.07,17.83 91.29,19.05 GPIO.27
MISO  (via drill 0.33)
  Top 0.152: v28.35,26.06 27.43,26.98 6.1,26.98 P1.19 | v53.49,38.41 53.95,38.41 54.1,38.25 59.59,38.25 61.87,40.54 72.85,40.54 75.13,38.25 79.25,38.25 v80.92,39.93 | v85.65,35.2 89.31,35.2 89.92,34.59 89.92,28.19 GPIO.21
  Bottom 0.152: v28.35,26.06 33.22,26.06 44.5,37.34 52.27,37.34 53.19,38.25 53.34,38.25 v53.49,38.41 | v85.65,35.2 v80.92,39.93
MOSI  (via drill 0.33)
  Top 0.152: v26.52,27.89 6.1,27.89 5.03,28.96 4.12,28.96 P1.18 | v27.89,29.26 30.18,29.26 v44.04,15.39 | v58.37,20.88 58.37,21.79 61.87,25.3 71.93,25.3 73,24.23 78.49,24.23 78.94,23.77 v82.3,23.77
  Bottom 0.152: v27.89,29.26 v26.52,27.89 | v44.04,15.39 46.33,17.68 53.8,17.68 54.1,17.98 55.32,17.98 55.63,17.68 57.76,19.81 57.76,20.27 v58.37,20.88 | v82.3,23.77 83.82,23.77 87.94,27.89 88.24,27.58 89.61,27.58 91.14,29.11 91.44,29.11 GPIO.19
N$2
  Top 0.152: Q2.2 30.02,49.53 32,47.55 32,46.94 U2.2
N$3
  Top 0.152: U2.3 32.61,46.79 32.61,46.33 32.16,45.87 24.08,45.87 20.42,49.53 Q2.1
N$12
  Top 0.152: U2.14 39.78,46.79 39.78,45.72 41.45,44.04 41.45,43.28 38.71,40.54 38.71,40.23 38.1,39.62 35.51,39.62 32,43.13 R5.2
N$13  (via drill 0.33)
  Top 0.152: v41.91,44.65 41.91,46.02 40.08,47.85 39.47,47.85 39.17,47.55 39.17,46.94 U2.13 | v42.82,43.74 42.82,37.8 45.72,34.9 45.72,17.68 49.99,13.41 53.49,13.41 54.56,12.34 54.56,7.92 56.08,6.4 56.08,5.79 57,4.88 62.33,4.88 65.84,1.37 74.83,1.37 77.57,4.12 77.57,7.16 v80.31,9.91 | v81.23,8.99 81.23,9.91 83.97,12.65 C6.+
  Bottom 0.152: v42.82,43.74 v41.91,44.65 | v81.23,8.99 v80.31,9.91
N$14  (via drill 0.33)
  Top 0.152: v47.55,6.4 47.24,6.1 47.24,3.81 C5.1 | v48.77,7.62 48.77,9.75 48.46,10.06 C4.+ 48.31,10.21 48.31,12.04 v46.18,14.17 | v32.92,48.16 31.55,49.53 31.55,52.12 U2.28 | v34.9,45.72 35.66,44.96 38.1,44.96 38.41,45.26 | 38.41,45.26 38.41,46.79 U2.12 | v44.96,15.39 41,19.36 41,37.03 42.06,38.1 v42.06,42.52 | v40.84,43.74 39.93,43.74 38.41,45.26
  Bottom 0.152: v48.77,7.62 v47.55,6.4 | v32.92,48.16 32.92,47.7 v34.9,45.72 | v44.96,15.39 v46.18,14.17 | v40.84,43.74 v42.06,42.52
N$15  (via drill 0.33)
  Top 0.152: v33.38,50.9 35.2,50.9 35.81,51.51 35.81,52.12 U2.21 | v27.74,44.65 27.74,40.69 28.96,39.47 C7.1
  Bottom 0.152: v33.38,50.9 30.48,48.01 30.33,48.01 27.74,45.41 v27.74,44.65
N$27
  Top 0.152: S1.O 52.58,46.48 52.58,33.83 49.53,30.79 49.53,30.18 50.44,29.26 50.44,20.73 54.25,16.92 54.25,14.33 55.93,12.65 55.93,11.43 R1.1
N$28
  Top 0.152: LED1.A 55.78,5.18 55.78,6.25 53.34,8.69 53.34,11.43 R1.2
PB0
  Top 0.152: DIGITAL_HEADER.4 69.8,16.46 69.8,13.72 65.23,9.14 59.13,9.14 58.83,8.84 58.22,8.84 57.91,9.14 57.91,15.85 54.71,19.05 U1.14
PB1
  Top 0.152: U1.15 A_D_HEADER.1
PB2
  Top 0.152: A_D_HEADER.2 68.58,21.64 62.33,21.64 U1.16
PB3
  Top 0.152: D2.C 80.16,21.64 79.7,21.64 77.42,23.93 68.73,23.93 68.58,24.08 A_D_HEADER.3 68.58,24.23 62.33,24.23 U1.17
PB4
  Top 0.152: 59.59,15.24 59.59,11.43 R4.2 | A_D_HEADER.4 U1.18 62.18,26.67 57.76,22.25 57.76,19.66 59.44,17.98 67.67,17.98 69.04,16.61 69.04,13.87 68.89,13.72 66.14,13.72 63.25,16.61 61.57,16.61 60.2,15.24 59.59,15.24 | 59.59,15.24 R3.2
PB5
  Top 0.152: D1.C 80.16,25.45 80.16,26.21 77.27,29.11 68.58,29.11 A_D_HEADER.5 68.58,29.26 62.33,29.26 U1.19
PC0
  Top 0.152: A_D_HEADER.9 68.58,39.47 62.33,39.47 U1.23
PC1
  Top 0.152: U1.24 A_D_HEADER.10
PC2
  Top 0.152: A_D_HEADER.11 68.58,44.5 62.33,44.5 U1.25
PC3
  Top 0.152: A_D_HEADER.12 68.58,47.09 62.33,47.09 U1.26
PC4
  Top 0.152: U1.27 A_D_HEADER.13
PC5
  Top 0.152: A_D_HEADER.14 68.58,52.12 62.33,52.12 U1.28
PD0
  Top 0.152: JP3.2 70.87,49.53 69.8,50.6 59.28,50.6 58.22,49.53 U1.2
PD1
  Top 0.152: U1.3 56.08,48.46 70.71,48.46 72.08,47.09 76.2,47.09 JP3.3
PD2
  Top 0.152: U1.4 55.78,43.28 69.65,43.28 70.71,44.35 76.2,44.35 JP3.4
PD3
  Top 0.152: JP3.5 70.87,41.91 69.8,42.98 55.78,42.98 54.71,41.91 U1.5
PD4
  Top 0.152: U1.6 56.08,40.84 73,40.84 74.37,39.47 76.2,39.47 JP3.6
PD5
  Top 0.152: DIGITAL_HEADER.1 71.63,30.48 71.48,30.33 59.28,30.33 55.63,26.67 U1.11
PD6
  Top 0.152: U1.12 58.52,28.04 76.2,28.04 DIGITAL_HEADER.2
PD7
  Top 0.152: DIGITAL_HEADER.3 76.2,25.45 72.24,25.45 69.95,27.74 60.81,27.74 54.71,21.64 U1.13
RST  (via drill 0.33)
  Top 0.152: JP3.1 76.2,52.12 71.48,52.12 70.1,53.49 56.08,53.49 54.71,52.12 U1.1 | v47.7,35.66 47.7,38.56 49.23,40.08 S2.4 | 54.1,20.12 53.49,19.51 53.49,18.59 55.93,16.15 55.93,15.24 R2.2 | 54.1,20.12 56.84,20.12 60.05,16.92 65.68,16.92 67.36,15.24 D3.C | 54.1,20.12 51.36,22.86 v51.36,31.7 52.88,33.22 52.88,41 53.03,41.15 v53.03,49.99
  Bottom 0.152: v47.7,35.66 49.23,34.14 49.23,33.68 S2.3 49.38,33.53 50.14,32.77 50.29,32.77 v51.36,31.7 | v53.03,49.99 53.03,50.75 54.25,51.97 54.56,51.97 U1.1
SCL  (via drill 0.33)
  Top 0.152: v2.44,30.94 2.44,36.73 3.96,38.25 3.96,38.86 P1.8 | v1.37,28.96 1.37,18.44 2.9,16.92 2.9,13.11 3.81,12.19 9.3,12.19 10.36,13.26 13.41,13.26 SV1.1 24.08,2.59 48.01,2.59 49.07,3.66 v50.29,3.66 | v93.73,46.02 93.73,7.32 91.14,4.72 90.98,4.72 89.92,3.66 89.92,3.5 87.33,0.91 v86.87,0.91 | v78.18,4.72 78.18,4.27 74.98,1.07 64.92,1.07 62.94,3.05 58.37,3.05 57.76,2.44 54.41,2.44 51.97,4.88 v51.51,4.88
  Bottom 0.152: v2.44,30.94 1.37,29.87 v1.37,28.96 | v93.73,46.02 92.81,46.94 91.44,46.94 GPIO.5 | v86.87,0.91 86.72,1.07 81.84,1.07 v78.18,4.72 | v50.29,3.66 v51.51,4.88
SCLK  (via drill 0.33)
  Top 0.152: v8.69,22.4 8.69,20.88 12.95,16.61 27.89,16.61 28.96,15.54 32.16,15.54 41.15,6.55 v43.13,6.55 | v82.75,16.92 84.12,16.92 87.63,20.42 87.63,22.1 88.7,23.16 90.53,23.16 91.44,24.08 GPIO.23
  Bottom 0.152: v8.69,22.4 6.1,24.99 P1.21 | v43.13,6.55 47.4,2.29 55.78,2.29 56.24,1.83 59.59,1.83 67.51,9.75 72.39,9.75 80.16,17.53 82.14,17.53 v82.75,16.92
SDA  (via drill 0.33)
  Top 0.152: P1.7 5.94,38.86 5.94,37.95 4.88,36.88 4.88,30.63 4.12,29.87 3.81,29.87 2.9,28.96 2.9,21.03 4.12,19.81 4.42,19.81 5.18,19.05 5.18,18.75 6.1,17.83 6.4,17.83 7.62,16.61 7.62,14.48 8.53,13.56 9.3,13.56 10.97,15.24 SV1.2 14.02,15.24 14.33,14.94 30.94,14.94 35.05,10.82 v35.51,10.82 | v78.64,37.64 77.57,37.64 77.27,37.95 61.72,37.95 v60.05,36.27
  Bottom 0.152: GPIO.3 91.14,49.23 90.98,49.23 90.07,48.31 89.92,48.31 89.46,48.77 89.31,48.62 88.09,48.62 78.64,39.17 v78.64,37.64 | v60.05,36.27 60.05,33.07 55.02,28.04 54.25,28.04 54.1,28.19 53.8,28.19 52.88,27.28 51.97,27.28 v35.51,10.82
VCC  (via drill 0.33)
  Top 0.152: 53.34,14.33 53.34,14.02 54.86,12.5 54.86,8.69 57.15,6.4 LED1.K | 53.34,14.33 53.34,15.24 R2.1 53.34,14.33 | A_D_HEADER.6 68.58,31.85 62.33,31.85 U1.20 62.18,31.7 59.74,31.7 57.61,29.57 55.78,29.57 54.71,30.63 54.1,30.63 53.49,31.24 53.49,34.9 55.02,36.42 | 55.02,36.42 U1.7 54.71,36.73 | 55.02,36.42 55.78,35.66 69.65,35.66 70.71,36.73 76.2,36.73 JP3.7 | 53.34,14.33 49.53,14.33 46.02,17.83 46.02,33.07 49.68,36.73 v51.36,36.73
  Bottom 0.152: v51.36,36.73 52.12,36.73 53.19,37.8 53.34,37.8 54.25,36.88 54.56,36.88 U1.7
XTAL1
  Top 0.152: C2.1 81.38,46.94 81.38,46.18 82.45,45.11 82.45,40.69 Q1.1 77.27,35.36 61.72,35.36 58.22,31.85 54.71,31.85 U1.9
XTAL2
  Top 0.152: Q1.2 82.45,35.51 82.45,31.55 81.38,30.48 C1.1 81.23,30.48 80.16,31.55 72.24,31.55 71.32,30.63 59.13,30.63 57.76,29.26 54.71,29.26 U1.10

### Text on the board
tPlace: 12 MHz | A5 | RST | 16V | A4 | 0 | 22pF | PIN1 | A3 | 1 | PGRM Power | 2.7K | A2 | 2 | USB1 | A1 | ~3 | A0 | 4 | USB2 | 0.1uF | WDPi | GND | VCC | AREF | GND | 16 MHz | ATMEGA328P | VCC | ~5 | 13 | ~6 | Reset / Switch | 12 | 22pF | 10uF | 7 | ~11 | 8 | ~10 | GND | ~9 | 5V | 10K | 10K | SDA | 10uF | SCL | 20K | Voltage Divider | Led Pullup | TinyRTC | To RPi | 0.1uF